# Altium schematic sheet data_left.SchDoc
size 241 x 584 mm; SheetNumber: 1; SheetTotal: 3
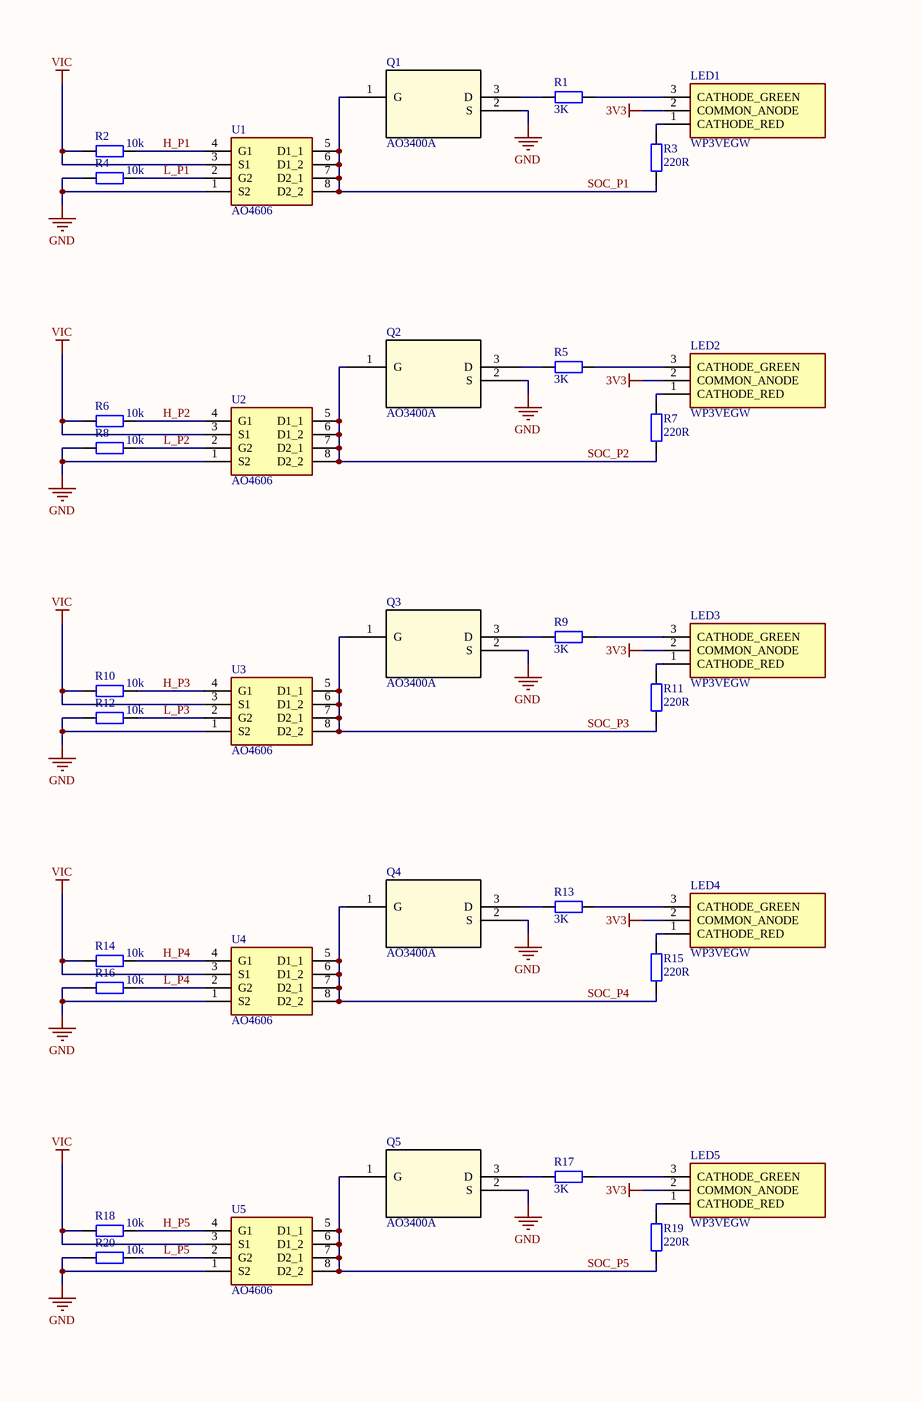
[diagram p0: data_left.SchDoc, top]
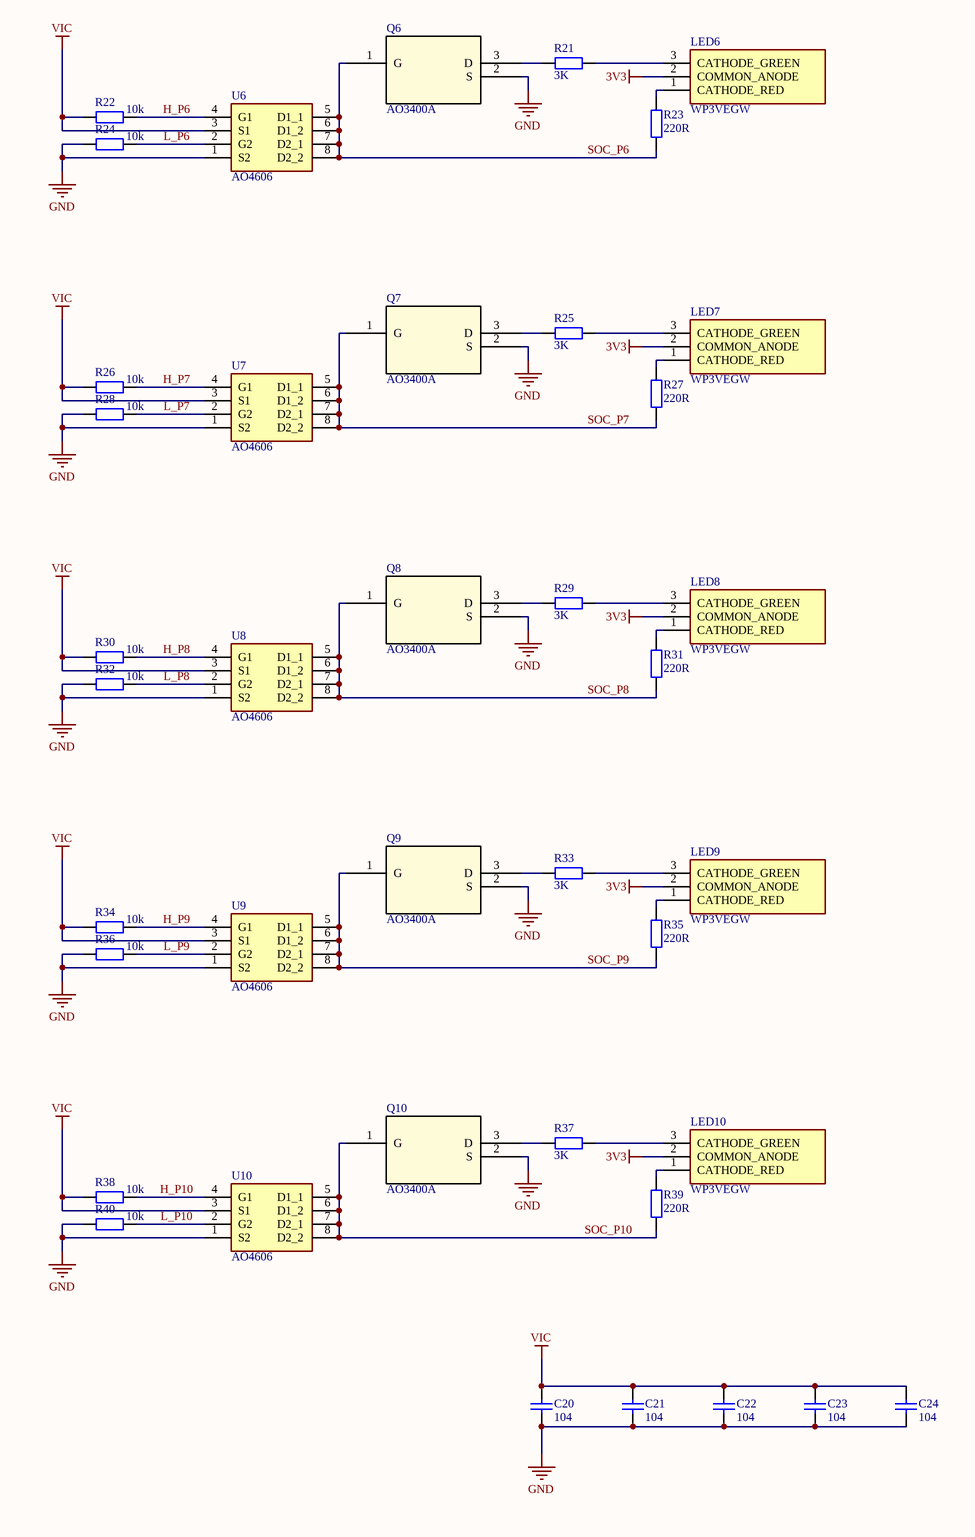
[diagram p1: data_left.SchDoc, bottom]

## Parts
C20  104  [tu 0805]
C21  104  [tu 0805]
C22  104  [tu 0805]
C23  104  [tu 0805]
C24  104  [tu 0805]
LED1  WP3VEGW  [WP3VEGW]
LED2  WP3VEGW  [WP3VEGW]
LED3  WP3VEGW  [WP3VEGW]
LED4  WP3VEGW  [WP3VEGW]
LED5  WP3VEGW  [WP3VEGW]
LED6  WP3VEGW  [WP3VEGW]
LED7  WP3VEGW  [WP3VEGW]
LED8  WP3VEGW  [WP3VEGW]
LED9  WP3VEGW  [WP3VEGW]
LED10  WP3VEGW  [WP3VEGW]
Q1  AO3400A  [SOT-23-3L_AOS]
Q2  AO3400A  [SOT-23-3L_AOS]
Q3  AO3400A  [SOT-23-3L_AOS]
Q4  AO3400A  [SOT-23-3L_AOS]
Q5  AO3400A  [SOT-23-3L_AOS]
Q6  AO3400A  [SOT-23-3L_AOS]
Q7  AO3400A  [SOT-23-3L_AOS]
Q8  AO3400A  [SOT-23-3L_AOS]
Q9  AO3400A  [SOT-23-3L_AOS]
Q10  AO3400A  [SOT-23-3L_AOS]
R1  3K  [tro smd 0805]
R2  10k  [tro smd 0805]
R3  220R  [tro smd 0805]
R4  10k  [tro smd 0805]
R5  3K  [tro smd 0805]
R6  10k  [tro smd 0805]
R7  220R  [tro smd 0805]
R8  10k  [tro smd 0805]
R9  3K  [tro smd 0805]
R10  10k  [tro smd 0805]
R11  220R  [tro smd 0805]
R12  10k  [tro smd 0805]
R13  3K  [tro smd 0805]
R14  10k  [tro smd 0805]
R15  220R  [tro smd 0805]
R16  10k  [tro smd 0805]
R17  3K  [tro smd 0805]
R18  10k  [tro smd 0805]
R19  220R  [tro smd 0805]
R20  10k  [tro smd 0805]
R21  3K  [tro smd 0805]
R22  10k  [tro smd 0805]
R23  220R  [tro smd 0805]
R24  10k  [tro smd 0805]
R25  3K  [tro smd 0805]
R26  10k  [tro smd 0805]
R27  220R  [tro smd 0805]
R28  10k  [tro smd 0805]
R29  3K  [tro smd 0805]
R30  10k  [tro smd 0805]
R31  220R  [tro smd 0805]
R32  10k  [tro smd 0805]
R33  3K  [tro smd 0805]
R34  10k  [tro smd 0805]
R35  220R  [tro smd 0805]
R36  10k  [tro smd 0805]
R37  3K  [tro smd 0805]
R38  10k  [tro smd 0805]
R39  220R  [tro smd 0805]
R40  10k  [tro smd 0805]
U1  AO4606  [SOIC127P600X175-8N]
U2  AO4606  [SOIC127P600X175-8N]
U3  AO4606  [SOIC127P600X175-8N]
U4  AO4606  [SOIC127P600X175-8N]
U5  AO4606  [SOIC127P600X175-8N]
U6  AO4606  [SOIC127P600X175-8N]
U7  AO4606  [SOIC127P600X175-8N]
U8  AO4606  [SOIC127P600X175-8N]
U9  AO4606  [SOIC127P600X175-8N]
U10  AO4606  [SOIC127P600X175-8N]

## Nets
3V3: LED1.2(COMMON_ANODE) LED2.2(COMMON_ANODE) LED3.2(COMMON_ANODE) LED4.2(COMMON_ANODE) LED5.2(COMMON_ANODE) LED6.2(COMMON_ANODE) LED7.2(COMMON_ANODE) LED8.2(COMMON_ANODE) LED9.2(COMMON_ANODE) LED10.2(COMMON_ANODE)
GND: C20.2 C21.2 C22.2 C23.2 C24.2 Q1.2(S) Q2.2(S) Q3.2(S) Q4.2(S) Q5.2(S) Q6.2(S) Q7.2(S) Q8.2(S) Q9.2(S) Q10.2(S) R4.1 R8.1 R12.1 R16.1 R20.1 R24.1 R28.1 R32.1 R36.1 R40.1 U1.1(S2) U2.1(S2) U3.1(S2) U4.1(S2) U5.1(S2) U6.1(S2) U7.1(S2) U8.1(S2) U9.1(S2) U10.1(S2)
VIC: C20.1 C21.1 C22.1 C23.1 C24.1 R2.1 R6.1 R10.1 R14.1 R18.1 R22.1 R26.1 R30.1 R34.1 R38.1 U1.3(S1) U2.3(S1) U3.3(S1) U4.3(S1) U5.3(S1) U6.3(S1) U7.3(S1) U8.3(S1) U9.3(S1) U10.3(S1)
H_P1: R2.2 U1.4(G1)
H_P2: R6.2 U2.4(G1)
H_P3: R10.2 U3.4(G1)
H_P4: R14.2 U4.4(G1)
H_P5: R18.2 U5.4(G1)
H_P6: R22.2 U6.4(G1)
H_P7: R26.2 U7.4(G1)
H_P8: R30.2 U8.4(G1)
H_P9: R34.2 U9.4(G1)
H_P10: R38.2 U10.4(G1)
L_P1: R4.2 U1.2(G2)
L_P2: R8.2 U2.2(G2)
L_P3: R12.2 U3.2(G2)
L_P4: R16.2 U4.2(G2)
L_P5: R20.2 U5.2(G2)
L_P6: R24.2 U6.2(G2)
L_P7: R28.2 U7.2(G2)
L_P8: R32.2 U8.2(G2)
L_P9: R36.2 U9.2(G2)
L_P10: R40.2 U10.2(G2)
SOC_P1: Q1.1(G) R3.1 U1.5(D1_1) U1.6(D1_2) U1.7(D2_1) U1.8(D2_2)
SOC_P2: Q2.1(G) R7.1 U2.5(D1_1) U2.6(D1_2) U2.7(D2_1) U2.8(D2_2)
SOC_P3: Q3.1(G) R11.1 U3.5(D1_1) U3.6(D1_2) U3.7(D2_1) U3.8(D2_2)
SOC_P4: Q4.1(G) R15.1 U4.5(D1_1) U4.6(D1_2) U4.7(D2_1) U4.8(D2_2)
SOC_P5: Q5.1(G) R19.1 U5.5(D1_1) U5.6(D1_2) U5.7(D2_1) U5.8(D2_2)
SOC_P6: Q6.1(G) R23.1 U6.5(D1_1) U6.6(D1_2) U6.7(D2_1) U6.8(D2_2)
SOC_P7: Q7.1(G) R27.1 U7.5(D1_1) U7.6(D1_2) U7.7(D2_1) U7.8(D2_2)
SOC_P8: Q8.1(G) R31.1 U8.5(D1_1) U8.6(D1_2) U8.7(D2_1) U8.8(D2_2)
SOC_P9: Q9.1(G) R35.1 U9.5(D1_1) U9.6(D1_2) U9.7(D2_1) U9.8(D2_2)
SOC_P10: Q10.1(G) R39.1 U10.5(D1_1) U10.6(D1_2) U10.7(D2_1) U10.8(D2_2)
NetLED1_1: LED1.1(CATHODE_RED) R3.2
NetLED1_3: LED1.3(CATHODE_GREEN) R1.1
NetLED2_1: LED2.1(CATHODE_RED) R7.2
NetLED2_3: LED2.3(CATHODE_GREEN) R5.1
NetLED3_1: LED3.1(CATHODE_RED) R11.2
NetLED3_3: LED3.3(CATHODE_GREEN) R9.1
NetLED4_1: LED4.1(CATHODE_RED) R15.2
NetLED4_3: LED4.3(CATHODE_GREEN) R13.1
NetLED5_1: LED5.1(CATHODE_RED) R19.2
NetLED5_3: LED5.3(CATHODE_GREEN) R17.1
NetLED6_1: LED6.1(CATHODE_RED) R23.2
NetLED6_3: LED6.3(CATHODE_GREEN) R21.1
NetLED7_1: LED7.1(CATHODE_RED) R27.2
NetLED7_3: LED7.3(CATHODE_GREEN) R25.1
NetLED8_1: LED8.1(CATHODE_RED) R31.2
NetLED8_3: LED8.3(CATHODE_GREEN) R29.1
NetLED9_1: LED9.1(CATHODE_RED) R35.2
NetLED9_3: LED9.3(CATHODE_GREEN) R33.1
NetLED10_1: LED10.1(CATHODE_RED) R39.2
NetLED10_3: LED10.3(CATHODE_GREEN) R37.1
NetQ1_3: Q1.3(D) R1.2
NetQ2_3: Q2.3(D) R5.2
NetQ3_3: Q3.3(D) R9.2
NetQ4_3: Q4.3(D) R13.2
NetQ5_3: Q5.3(D) R17.2
NetQ6_3: Q6.3(D) R21.2
NetQ7_3: Q7.3(D) R25.2
NetQ8_3: Q8.3(D) R29.2
NetQ9_3: Q9.3(D) R33.2
NetQ10_3: Q10.3(D) R37.2

## Library data of the parts
C20-C24 = Tu 0805 106 16V 10%: Dán; Ten_Linh_Kien: Tụ 0805 106-10uF 10% 16V; So_Chan: 2; Don_Vi: Con; Ma_Hang: MH004553; Chung_Loai: Dán; Kieu_Chan: *
LED1-LED10 = WP3VEGW: LED RED/GREEN 3mm; Manufacturer_Name: Kingbright; Datasheet Link: https://www.mouser.com/datasheet/2/216/WP3VEGW-47873.pdf; Height: 6.93mm; Manufacturer_Part_Number: WP3VEGW; Mouser Part Number: 604-WP3VEGW; Mouser Price/Stock: https://www.mouser.co.uk/ProductDetail/Kingbright/WP3VEGW?qs=58z0TXQGVSS6OtgxGPtI4A%3D%3D; Arrow Part Number: WP3VEGW; Arrow Price/Stock: https://www.arrow.com/en/products/wp3vegw/kingbright?region=nac
Q1-Q10 = AO3400A: N-MOSFET; Mfr_Name: Alpha and Omega Semiconductor; Type: DEV; Copyright: Copyright (C) 2023 Ultra Librarian. All rights reserved.; Manufacturer_Part_Number: AO3400A; RefDes: RefDes
R1-R40 = Tro 0805 1% 10k: Dán; Don_Vi: Con; So_Chan: 2; Ten_Linh_Kien: Trở 0805 1% 10k; Ma_Hang: MH005473; Chung_Loai: Dán; Kieu_Chan: *
U1-U10 = AO4606: SMALL SIGNAL FIELD-EFFECT TRANSISTOR, 6A I(D), 30V, 2-ELEMENT, N-CHANNEL AND P-CHANNEL, SILICON, METAL-OXIDE SEMICONDUCTOR FET; Manufacturer_Name: Alpha & Omega Semiconductors; Geometry.Height: 1.75mm; Manufacturer_Part_Number: AO4606; Mouser Part Number: *; Mouser Price/Stock: *; Arrow Part Number: AO4606; Arrow Price/Stock: https://www.arrow.com/en/products/ao4606/alpha-and-omega-semiconductor?region=nac; Datasheet Link: https://datasheet.datasheetarchive.com/originals/distributors/Datasheets-AOS/DSAAOS100079.pdf